# Altium schematic sheet Hoja_Buck2.SchDoc: Hoja_Buck2
size A4; SheetNumber: 6; SheetTotal: 6
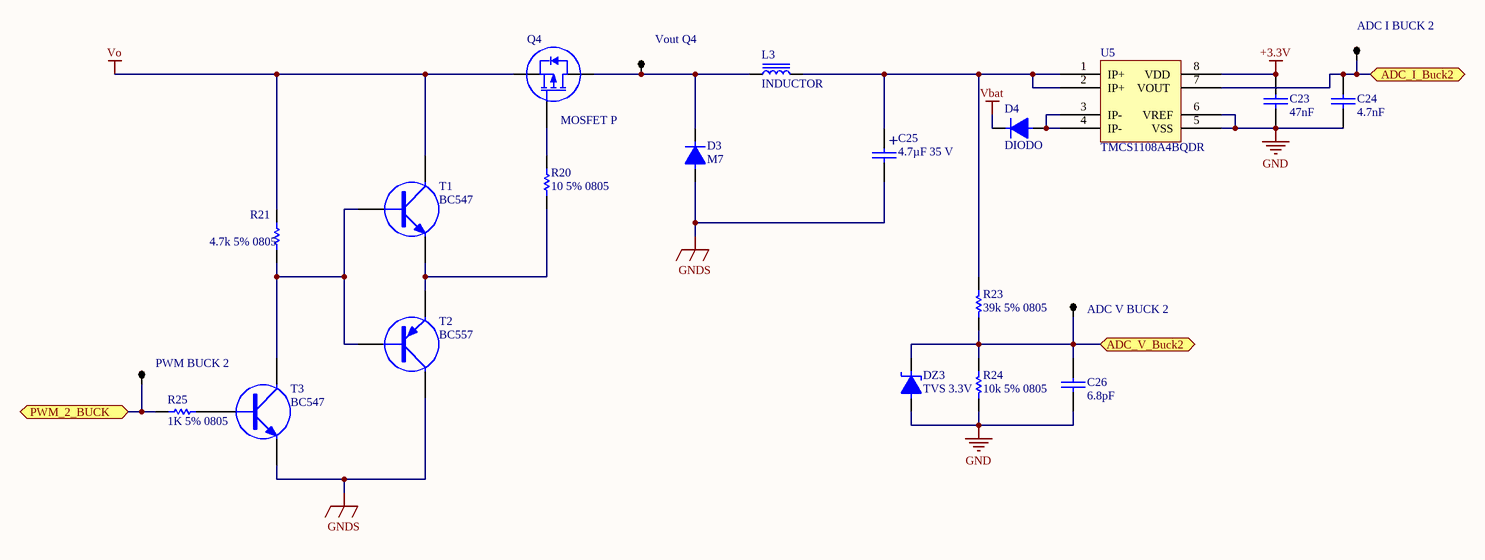
[diagram p0: Hoja_Buck2.SchDoc]

## Parts
ADC_I_BUCK_2  (no value)  [TPTH]
ADC_V_BUCK_2  (no value)  [TPTH]
C23  47nF  [0805]
C24  4.7nF  [0805]
C25  4.7µF 35 V  [CAPSMD8x8.3]
C26  6.8pF  [0805]
D3  M7  [DO-214AC]
D4  DIODO  [SOD123]
DZ3  TVS 3.3V  [sod123]
L3  INDUCTOR  [IND_HCTI-220-5.8]
PWM_BUCK_2  (no value)  [TPTH]
Q4  MOSFET P  [TO-220 V]
R20  10 5% 0805  [0805]
R21  4.7k 5% 0805  [0805]
R23  39k 5% 0805  [0805]
R24  10k 5% 0805  [0805]
R25  1K 5% 0805  [0805]
T1  BC547  [SOT23-3]
T2  BC557  [SOT23-3]
T3  BC547  [SOT23-3]
U5  TMCS1108A4BQDR  [SOIC8]
Vout_Q4  Vout Q4  [TPTH]  (value not drawn)

## Ports
ADC_I_Buck2 (bidir), ADC_V_Buck2 (bidir), PWM_2_BUCK (bidir)

## Nets
+3.3V: C23.1 U5.8(VDD)
GND: C23.2 C24.2 C26.2 DZ3.1 R24.1 U5.5(VSS) U5.6(VREF)
GNDS: C25.2 D3.1 T2.2(C) T3.3(E)
Vbat: D4.2
Vo: Q4.3(S) R21.1 T1.2(C)
ADC_I_Buck2: ADC_I_BUCK_2.1 C24.1 U5.7(VOUT) ; port ADC_I_Buck2
ADC_V_Buck2: ADC_V_BUCK_2.1 C26.1 DZ3.2 R23.1 R24.2 ; port ADC_V_Buck2
PWM_2_BUCK: PWM_BUCK_2.1 R25.1 ; port PWM_2_BUCK
NetC25_1: C25.1 L3.2 R23.2 U5.1(IP+) U5.2(IP+)
NetD3_2: D3.2 L3.1 Q4.2(D) Vout_Q4.1
NetD4_1: D4.1 U5.3(IP-) U5.4(IP-)
NetQ4_1: Q4.1(G) R20.1
NetR20_2: R20.2 T1.3(E) T2.3(E)
NetR21_2: R21.2 T1.1(B) T2.1(B) T3.2(C)
NetR25_2: R25.2 T3.1(B)

## Notes on the sheet
- Title:
- Size:
- Author:
- A4
- Sheet
- of
- Revision:
- File:
- Date:
- (in symbol CAPPOL) +

## Library data of the parts
ADC_I_BUCK_2 ADC_V_BUCK_2 PWM_BUCK_2 Vout_Q4 = TP
C23 C24 C26 = CAP
C25 = CAPPOL
D3 = DIODO: Diodos Estándar 1000 V 1A Montaje en superficie SMA
DZ3 = DIODO ZENER
L3 = INDUCTOR: https://www.delevan.com/-/media/Project/Altramotion/shared/files/Literature/brand/Delevan/pdf/powerinductor/radialleaded/powertoroids/page103_106_ptseries.pdf
R20 R21 R23-R25 = RES
T1 T3 = TRANSISTOR NPN: Transistores - Bipolar (BJT) - Simple NPN 45 V 100 mA 300MHz 500 mW Orificio pasante TO-92-3
T2 = TRANSISTOR PNP: Transistores - Bipolar (BJT) - Simple PNP 45 V 100 mA 150MHz 500 mW Orificio pasante TO-92-3
U5 = MLX91221KDC: Sensores de corriente 1 canal Efecto Hall Bidireccional 8-SOIC (ancho 0.154", 3.90mm)